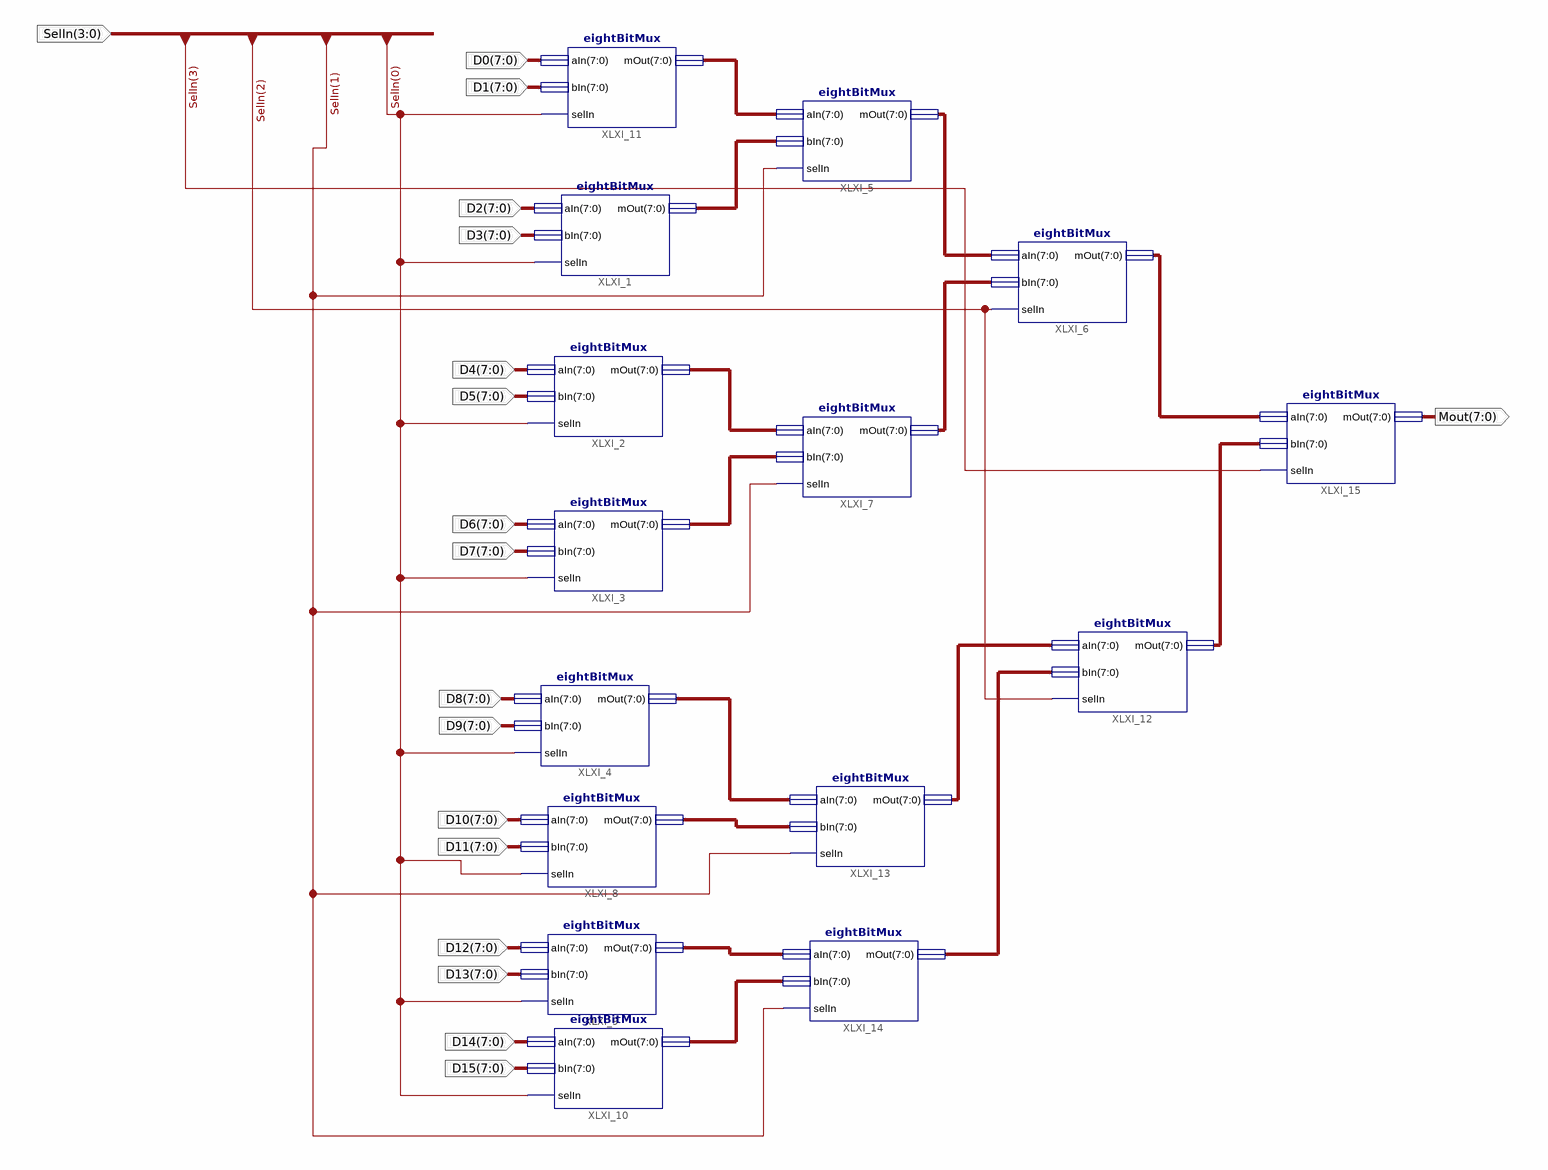
[diagram p0: schematic sheet 1]
// Xilinx ISE schematic eightBit16Mux.sch (spartan3e) as structural Verilog: 15 symbols, 18 ports
module eightBit16Mux (
  input  [3:0] SelIn,
  input  [7:0] D0,
  input  [7:0] D1,
  input  [7:0] D2,
  input  [7:0] D3,
  input  [7:0] D4,
  input  [7:0] D5,
  input  [7:0] D6,
  input  [7:0] D7,
  input  [7:0] D8,
  input  [7:0] D9,
  input  [7:0] D10,
  input  [7:0] D11,
  input  [7:0] D12,
  input  [7:0] D13,
  input  [7:0] D14,
  input  [7:0] D15,
  output [7:0] Mout
);

  wire [7:0] XLXN_1, XLXN_2, XLXN_3, XLXN_4, XLXN_5, XLXN_6, XLXN_7, XLXN_8, XLXN_17, XLXN_18, XLXN_22,
       XLXN_23, XLXN_26, XLXN_28;

  eightBitMux XLXI_1 (.aIn(D2), .bIn(D3), .selIn(SelIn[0]), .mOut(XLXN_2));
  eightBitMux XLXI_2 (.aIn(D4), .bIn(D5), .selIn(SelIn[0]), .mOut(XLXN_3));
  eightBitMux XLXI_3 (.aIn(D6), .bIn(D7), .selIn(SelIn[0]), .mOut(XLXN_4));
  eightBitMux XLXI_4 (.aIn(D8), .bIn(D9), .selIn(SelIn[0]), .mOut(XLXN_5));
  eightBitMux XLXI_5 (.aIn(XLXN_1), .bIn(XLXN_2), .selIn(SelIn[1]), .mOut(XLXN_17));
  eightBitMux XLXI_6 (.aIn(XLXN_17), .bIn(XLXN_18), .selIn(SelIn[2]), .mOut(XLXN_28));
  eightBitMux XLXI_7 (.aIn(XLXN_3), .bIn(XLXN_4), .selIn(SelIn[1]), .mOut(XLXN_18));
  eightBitMux XLXI_8 (.aIn(D10), .bIn(D11), .selIn(SelIn[0]), .mOut(XLXN_6));
  eightBitMux XLXI_9 (.aIn(D12), .bIn(D13), .selIn(SelIn[0]), .mOut(XLXN_7));
  eightBitMux XLXI_10 (.aIn(D14), .bIn(D15), .selIn(SelIn[0]), .mOut(XLXN_8));
  eightBitMux XLXI_11 (.aIn(D0), .bIn(D1), .selIn(SelIn[0]), .mOut(XLXN_1));
  eightBitMux XLXI_12 (.aIn(XLXN_22), .bIn(XLXN_23), .selIn(SelIn[2]), .mOut(XLXN_26));
  eightBitMux XLXI_13 (.aIn(XLXN_5), .bIn(XLXN_6), .selIn(SelIn[1]), .mOut(XLXN_22));
  eightBitMux XLXI_14 (.aIn(XLXN_7), .bIn(XLXN_8), .selIn(SelIn[1]), .mOut(XLXN_23));
  eightBitMux XLXI_15 (.aIn(XLXN_28), .bIn(XLXN_26), .selIn(SelIn[3]), .mOut(Mout));
endmodule
